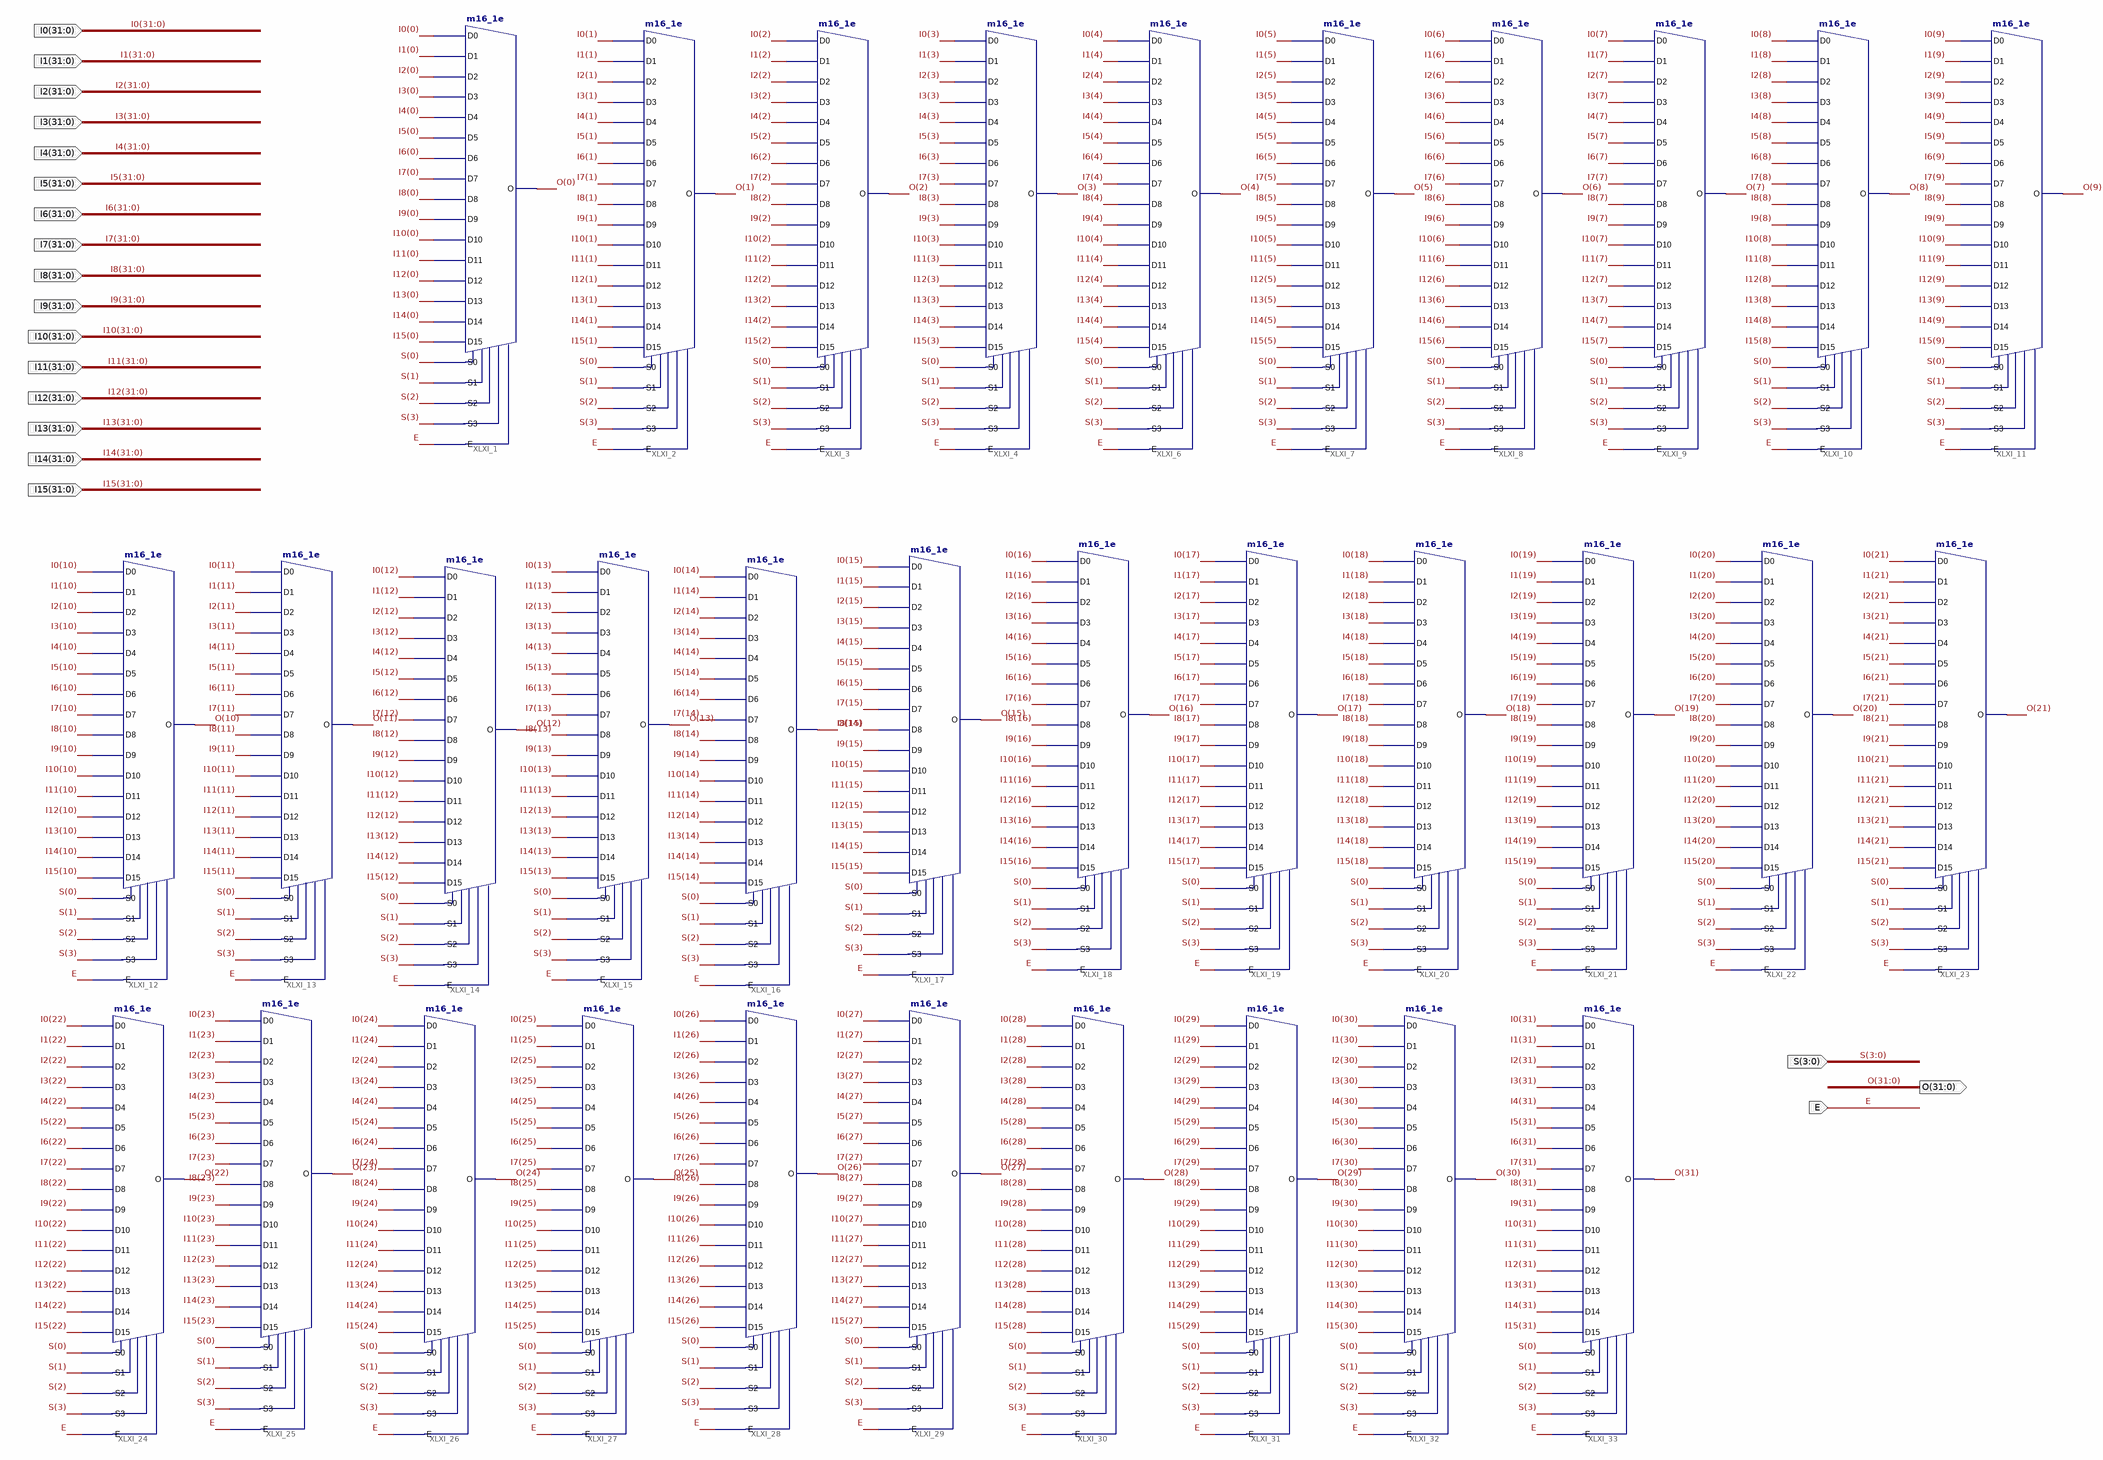
[diagram p0: schematic sheet 1]
// Xilinx ISE schematic mux32.sch (spartan3e) as structural Verilog: 32 symbols, 19 ports
module mux32 (
  input  [31:0] I0,
  input  [31:0] I1,
  input  [31:0] I2,
  input  [31:0] I3,
  input  [31:0] I4,
  input  [31:0] I5,
  input  [31:0] I6,
  input  [31:0] I7,
  input  [31:0] I8,
  input  [31:0] I9,
  input  [31:0] I10,
  input  [31:0] I11,
  input  [31:0] I12,
  input  [31:0] I13,
  input  [31:0] I14,
  input  [31:0] I15,
  input  E,
  input  [3:0] S,
  output [31:0] O
);

  m16_1e XLXI_1 (
    .D0(I0[0]), .D1(I1[0]), .D10(I10[0]), .D11(I11[0]), .D12(I12[0]), .D13(I13[0]), .D14(I14[0]),
    .D15(I15[0]), .D2(I2[0]), .D3(I3[0]), .D4(I4[0]), .D5(I5[0]), .D6(I6[0]), .D7(I7[0]), .D8(I8[0]),
    .D9(I9[0]), .E(E), .S0(S[0]), .S1(S[1]), .S2(S[2]), .S3(S[3]), .O(O[0]));
  m16_1e XLXI_2 (
    .D0(I0[1]), .D1(I1[1]), .D10(I10[1]), .D11(I11[1]), .D12(I12[1]), .D13(I13[1]), .D14(I14[1]),
    .D15(I15[1]), .D2(I2[1]), .D3(I3[1]), .D4(I4[1]), .D5(I5[1]), .D6(I6[1]), .D7(I7[1]), .D8(I8[1]),
    .D9(I9[1]), .E(E), .S0(S[0]), .S1(S[1]), .S2(S[2]), .S3(S[3]), .O(O[1]));
  m16_1e XLXI_4 (
    .D0(I0[3]), .D1(I1[3]), .D10(I10[3]), .D11(I11[3]), .D12(I12[3]), .D13(I13[3]), .D14(I14[3]),
    .D15(I15[3]), .D2(I2[3]), .D3(I3[3]), .D4(I4[3]), .D5(I5[3]), .D6(I6[3]), .D7(I7[3]), .D8(I8[3]),
    .D9(I9[3]), .E(E), .S0(S[0]), .S1(S[1]), .S2(S[2]), .S3(S[3]), .O(O[3]));
  m16_1e XLXI_3 (
    .D0(I0[2]), .D1(I1[2]), .D10(I10[2]), .D11(I11[2]), .D12(I12[2]), .D13(I13[2]), .D14(I14[2]),
    .D15(I15[2]), .D2(I2[2]), .D3(I3[2]), .D4(I4[2]), .D5(I5[2]), .D6(I6[2]), .D7(I7[2]), .D8(I8[2]),
    .D9(I9[2]), .E(E), .S0(S[0]), .S1(S[1]), .S2(S[2]), .S3(S[3]), .O(O[2]));
  m16_1e XLXI_6 (
    .D0(I0[4]), .D1(I1[4]), .D10(I10[4]), .D11(I11[4]), .D12(I12[4]), .D13(I13[4]), .D14(I14[4]),
    .D15(I15[4]), .D2(I2[4]), .D3(I3[4]), .D4(I4[4]), .D5(I5[4]), .D6(I6[4]), .D7(I7[4]), .D8(I8[4]),
    .D9(I9[4]), .E(E), .S0(S[0]), .S1(S[1]), .S2(S[2]), .S3(S[3]), .O(O[4]));
  m16_1e XLXI_7 (
    .D0(I0[5]), .D1(I1[5]), .D10(I10[5]), .D11(I11[5]), .D12(I12[5]), .D13(I13[5]), .D14(I14[5]),
    .D15(I15[5]), .D2(I2[5]), .D3(I3[5]), .D4(I4[5]), .D5(I5[5]), .D6(I6[5]), .D7(I7[5]), .D8(I8[5]),
    .D9(I9[5]), .E(E), .S0(S[0]), .S1(S[1]), .S2(S[2]), .S3(S[3]), .O(O[5]));
  m16_1e XLXI_8 (
    .D0(I0[6]), .D1(I1[6]), .D10(I10[6]), .D11(I11[6]), .D12(I12[6]), .D13(I13[6]), .D14(I14[6]),
    .D15(I15[6]), .D2(I2[6]), .D3(I3[6]), .D4(I4[6]), .D5(I5[6]), .D6(I6[6]), .D7(I7[6]), .D8(I8[6]),
    .D9(I9[6]), .E(E), .S0(S[0]), .S1(S[1]), .S2(S[2]), .S3(S[3]), .O(O[6]));
  m16_1e XLXI_9 (
    .D0(I0[7]), .D1(I1[7]), .D10(I10[7]), .D11(I11[7]), .D12(I12[7]), .D13(I13[7]), .D14(I14[7]),
    .D15(I15[7]), .D2(I2[7]), .D3(I3[7]), .D4(I4[7]), .D5(I5[7]), .D6(I6[7]), .D7(I7[7]), .D8(I8[7]),
    .D9(I9[7]), .E(E), .S0(S[0]), .S1(S[1]), .S2(S[2]), .S3(S[3]), .O(O[7]));
  m16_1e XLXI_10 (
    .D0(I0[8]), .D1(I1[8]), .D10(I10[8]), .D11(I11[8]), .D12(I12[8]), .D13(I13[8]), .D14(I14[8]),
    .D15(I15[8]), .D2(I2[8]), .D3(I3[8]), .D4(I4[8]), .D5(I5[8]), .D6(I6[8]), .D7(I7[8]), .D8(I8[8]),
    .D9(I9[8]), .E(E), .S0(S[0]), .S1(S[1]), .S2(S[2]), .S3(S[3]), .O(O[8]));
  m16_1e XLXI_11 (
    .D0(I0[9]), .D1(I1[9]), .D10(I10[9]), .D11(I11[9]), .D12(I12[9]), .D13(I13[9]), .D14(I14[9]),
    .D15(I15[9]), .D2(I2[9]), .D3(I3[9]), .D4(I4[9]), .D5(I5[9]), .D6(I6[9]), .D7(I7[9]), .D8(I8[9]),
    .D9(I9[9]), .E(E), .S0(S[0]), .S1(S[1]), .S2(S[2]), .S3(S[3]), .O(O[9]));
  m16_1e XLXI_12 (
    .D0(I0[10]), .D1(I1[10]), .D10(I10[10]), .D11(I11[10]), .D12(I12[10]), .D13(I13[10]), .D14(I14[10]),
    .D15(I15[10]), .D2(I2[10]), .D3(I3[10]), .D4(I4[10]), .D5(I5[10]), .D6(I6[10]), .D7(I7[10]), .D8(I8[10]),
    .D9(I9[10]), .E(E), .S0(S[0]), .S1(S[1]), .S2(S[2]), .S3(S[3]), .O(O[10]));
  m16_1e XLXI_13 (
    .D0(I0[11]), .D1(I1[11]), .D10(I10[11]), .D11(I11[11]), .D12(I12[11]), .D13(I13[11]), .D14(I14[11]),
    .D15(I15[11]), .D2(I2[11]), .D3(I3[11]), .D4(I4[11]), .D5(I5[11]), .D6(I6[11]), .D7(I7[11]), .D8(I8[11]),
    .D9(I9[11]), .E(E), .S0(S[0]), .S1(S[1]), .S2(S[2]), .S3(S[3]), .O(O[11]));
  m16_1e XLXI_14 (
    .D0(I0[12]), .D1(I1[12]), .D10(I10[12]), .D11(I11[12]), .D12(I12[12]), .D13(I13[12]), .D14(I14[12]),
    .D15(I15[12]), .D2(I2[12]), .D3(I3[12]), .D4(I4[12]), .D5(I5[12]), .D6(I6[12]), .D7(I7[12]), .D8(I8[12]),
    .D9(I9[12]), .E(E), .S0(S[0]), .S1(S[1]), .S2(S[2]), .S3(S[3]), .O(O[12]));
  m16_1e XLXI_15 (
    .D0(I0[13]), .D1(I1[13]), .D10(I10[13]), .D11(I11[13]), .D12(I12[13]), .D13(I13[13]), .D14(I14[13]),
    .D15(I15[13]), .D2(I2[13]), .D3(I3[13]), .D4(I4[13]), .D5(I5[13]), .D6(I6[13]), .D7(I7[13]), .D8(I8[13]),
    .D9(I9[13]), .E(E), .S0(S[0]), .S1(S[1]), .S2(S[2]), .S3(S[3]), .O(O[13]));
  m16_1e XLXI_16 (
    .D0(I0[14]), .D1(I1[14]), .D10(I10[14]), .D11(I11[14]), .D12(I12[14]), .D13(I13[14]), .D14(I14[14]),
    .D15(I15[14]), .D2(I2[14]), .D3(I3[14]), .D4(I4[14]), .D5(I5[14]), .D6(I6[14]), .D7(I7[14]), .D8(I8[14]),
    .D9(I9[14]), .E(E), .S0(S[0]), .S1(S[1]), .S2(S[2]), .S3(S[3]), .O(O[14]));
  m16_1e XLXI_17 (
    .D0(I0[15]), .D1(I1[15]), .D10(I10[15]), .D11(I11[15]), .D12(I12[15]), .D13(I13[15]), .D14(I14[15]),
    .D15(I15[15]), .D2(I2[15]), .D3(I3[15]), .D4(I4[15]), .D5(I5[15]), .D6(I6[15]), .D7(I7[15]), .D8(I8[15]),
    .D9(I9[15]), .E(E), .S0(S[0]), .S1(S[1]), .S2(S[2]), .S3(S[3]), .O(O[15]));
  m16_1e XLXI_18 (
    .D0(I0[16]), .D1(I1[16]), .D10(I10[16]), .D11(I11[16]), .D12(I12[16]), .D13(I13[16]), .D14(I14[16]),
    .D15(I15[16]), .D2(I2[16]), .D3(I3[16]), .D4(I4[16]), .D5(I5[16]), .D6(I6[16]), .D7(I7[16]), .D8(I8[16]),
    .D9(I9[16]), .E(E), .S0(S[0]), .S1(S[1]), .S2(S[2]), .S3(S[3]), .O(O[16]));
  m16_1e XLXI_19 (
    .D0(I0[17]), .D1(I1[17]), .D10(I10[17]), .D11(I11[17]), .D12(I12[17]), .D13(I13[17]), .D14(I14[17]),
    .D15(I15[17]), .D2(I2[17]), .D3(I3[17]), .D4(I4[17]), .D5(I5[17]), .D6(I6[17]), .D7(I7[17]), .D8(I8[17]),
    .D9(I9[17]), .E(E), .S0(S[0]), .S1(S[1]), .S2(S[2]), .S3(S[3]), .O(O[17]));
  m16_1e XLXI_20 (
    .D0(I0[18]), .D1(I1[18]), .D10(I10[18]), .D11(I11[18]), .D12(I12[18]), .D13(I13[18]), .D14(I14[18]),
    .D15(I15[18]), .D2(I2[18]), .D3(I3[18]), .D4(I4[18]), .D5(I5[18]), .D6(I6[18]), .D7(I7[18]), .D8(I8[18]),
    .D9(I9[18]), .E(E), .S0(S[0]), .S1(S[1]), .S2(S[2]), .S3(S[3]), .O(O[18]));
  m16_1e XLXI_21 (
    .D0(I0[19]), .D1(I1[19]), .D10(I10[19]), .D11(I11[19]), .D12(I12[19]), .D13(I13[19]), .D14(I14[19]),
    .D15(I15[19]), .D2(I2[19]), .D3(I3[19]), .D4(I4[19]), .D5(I5[19]), .D6(I6[19]), .D7(I7[19]), .D8(I8[19]),
    .D9(I9[19]), .E(E), .S0(S[0]), .S1(S[1]), .S2(S[2]), .S3(S[3]), .O(O[19]));
  m16_1e XLXI_22 (
    .D0(I0[20]), .D1(I1[20]), .D10(I10[20]), .D11(I11[20]), .D12(I12[20]), .D13(I13[20]), .D14(I14[20]),
    .D15(I15[20]), .D2(I2[20]), .D3(I3[20]), .D4(I4[20]), .D5(I5[20]), .D6(I6[20]), .D7(I7[20]), .D8(I8[20]),
    .D9(I9[20]), .E(E), .S0(S[0]), .S1(S[1]), .S2(S[2]), .S3(S[3]), .O(O[20]));
  m16_1e XLXI_23 (
    .D0(I0[21]), .D1(I1[21]), .D10(I10[21]), .D11(I11[21]), .D12(I12[21]), .D13(I13[21]), .D14(I14[21]),
    .D15(I15[21]), .D2(I2[21]), .D3(I3[21]), .D4(I4[21]), .D5(I5[21]), .D6(I6[21]), .D7(I7[21]), .D8(I8[21]),
    .D9(I9[21]), .E(E), .S0(S[0]), .S1(S[1]), .S2(S[2]), .S3(S[3]), .O(O[21]));
  m16_1e XLXI_24 (
    .D0(I0[22]), .D1(I1[22]), .D10(I10[22]), .D11(I11[22]), .D12(I12[22]), .D13(I13[22]), .D14(I14[22]),
    .D15(I15[22]), .D2(I2[22]), .D3(I3[22]), .D4(I4[22]), .D5(I5[22]), .D6(I6[22]), .D7(I7[22]), .D8(I8[22]),
    .D9(I9[22]), .E(E), .S0(S[0]), .S1(S[1]), .S2(S[2]), .S3(S[3]), .O(O[22]));
  m16_1e XLXI_25 (
    .D0(I0[23]), .D1(I1[23]), .D10(I10[23]), .D11(I11[23]), .D12(I12[23]), .D13(I13[23]), .D14(I14[23]),
    .D15(I15[23]), .D2(I2[23]), .D3(I3[23]), .D4(I4[23]), .D5(I5[23]), .D6(I6[23]), .D7(I7[23]), .D8(I8[23]),
    .D9(I9[23]), .E(E), .S0(S[0]), .S1(S[1]), .S2(S[2]), .S3(S[3]), .O(O[23]));
  m16_1e XLXI_26 (
    .D0(I0[24]), .D1(I1[24]), .D10(I10[24]), .D11(I11[24]), .D12(I12[24]), .D13(I13[24]), .D14(I14[24]),
    .D15(I15[24]), .D2(I2[24]), .D3(I3[24]), .D4(I4[24]), .D5(I5[24]), .D6(I6[24]), .D7(I7[24]), .D8(I8[24]),
    .D9(I9[24]), .E(E), .S0(S[0]), .S1(S[1]), .S2(S[2]), .S3(S[3]), .O(O[24]));
  m16_1e XLXI_27 (
    .D0(I0[25]), .D1(I1[25]), .D10(I10[25]), .D11(I11[25]), .D12(I12[25]), .D13(I13[25]), .D14(I14[25]),
    .D15(I15[25]), .D2(I2[25]), .D3(I3[25]), .D4(I4[25]), .D5(I5[25]), .D6(I6[25]), .D7(I7[25]), .D8(I8[25]),
    .D9(I9[25]), .E(E), .S0(S[0]), .S1(S[1]), .S2(S[2]), .S3(S[3]), .O(O[25]));
  m16_1e XLXI_28 (
    .D0(I0[26]), .D1(I1[26]), .D10(I10[26]), .D11(I11[26]), .D12(I12[26]), .D13(I13[26]), .D14(I14[26]),
    .D15(I15[26]), .D2(I2[26]), .D3(I3[26]), .D4(I4[26]), .D5(I5[26]), .D6(I6[26]), .D7(I7[26]), .D8(I8[26]),
    .D9(I9[26]), .E(E), .S0(S[0]), .S1(S[1]), .S2(S[2]), .S3(S[3]), .O(O[26]));
  m16_1e XLXI_29 (
    .D0(I0[27]), .D1(I1[27]), .D10(I10[27]), .D11(I11[27]), .D12(I12[27]), .D13(I13[27]), .D14(I14[27]),
    .D15(I15[27]), .D2(I2[27]), .D3(I3[27]), .D4(I4[27]), .D5(I5[27]), .D6(I6[27]), .D7(I7[27]), .D8(I8[27]),
    .D9(I9[27]), .E(E), .S0(S[0]), .S1(S[1]), .S2(S[2]), .S3(S[3]), .O(O[27]));
  m16_1e XLXI_30 (
    .D0(I0[28]), .D1(I1[28]), .D10(I10[28]), .D11(I11[28]), .D12(I12[28]), .D13(I13[28]), .D14(I14[28]),
    .D15(I15[28]), .D2(I2[28]), .D3(I3[28]), .D4(I4[28]), .D5(I5[28]), .D6(I6[28]), .D7(I7[28]), .D8(I8[28]),
    .D9(I9[28]), .E(E), .S0(S[0]), .S1(S[1]), .S2(S[2]), .S3(S[3]), .O(O[28]));
  m16_1e XLXI_31 (
    .D0(I0[29]), .D1(I1[29]), .D10(I10[29]), .D11(I11[29]), .D12(I12[29]), .D13(I13[29]), .D14(I14[29]),
    .D15(I15[29]), .D2(I2[29]), .D3(I3[29]), .D4(I4[29]), .D5(I5[29]), .D6(I6[29]), .D7(I7[29]), .D8(I8[29]),
    .D9(I9[29]), .E(E), .S0(S[0]), .S1(S[1]), .S2(S[2]), .S3(S[3]), .O(O[29]));
  m16_1e XLXI_32 (
    .D0(I0[30]), .D1(I1[30]), .D10(I10[30]), .D11(I11[30]), .D12(I12[30]), .D13(I13[30]), .D14(I14[30]),
    .D15(I15[30]), .D2(I2[30]), .D3(I3[30]), .D4(I4[30]), .D5(I5[30]), .D6(I6[30]), .D7(I7[30]), .D8(I8[30]),
    .D9(I9[30]), .E(E), .S0(S[0]), .S1(S[1]), .S2(S[2]), .S3(S[3]), .O(O[30]));
  m16_1e XLXI_33 (
    .D0(I0[31]), .D1(I1[31]), .D10(I10[31]), .D11(I11[31]), .D12(I12[31]), .D13(I13[31]), .D14(I14[31]),
    .D15(I15[31]), .D2(I2[31]), .D3(I3[31]), .D4(I4[31]), .D5(I5[31]), .D6(I6[31]), .D7(I7[31]), .D8(I8[31]),
    .D9(I9[31]), .E(E), .S0(S[0]), .S1(S[1]), .S2(S[2]), .S3(S[3]), .O(O[31]));
endmodule
